# Altium project CC2511 Assignment 2.PrjPcb
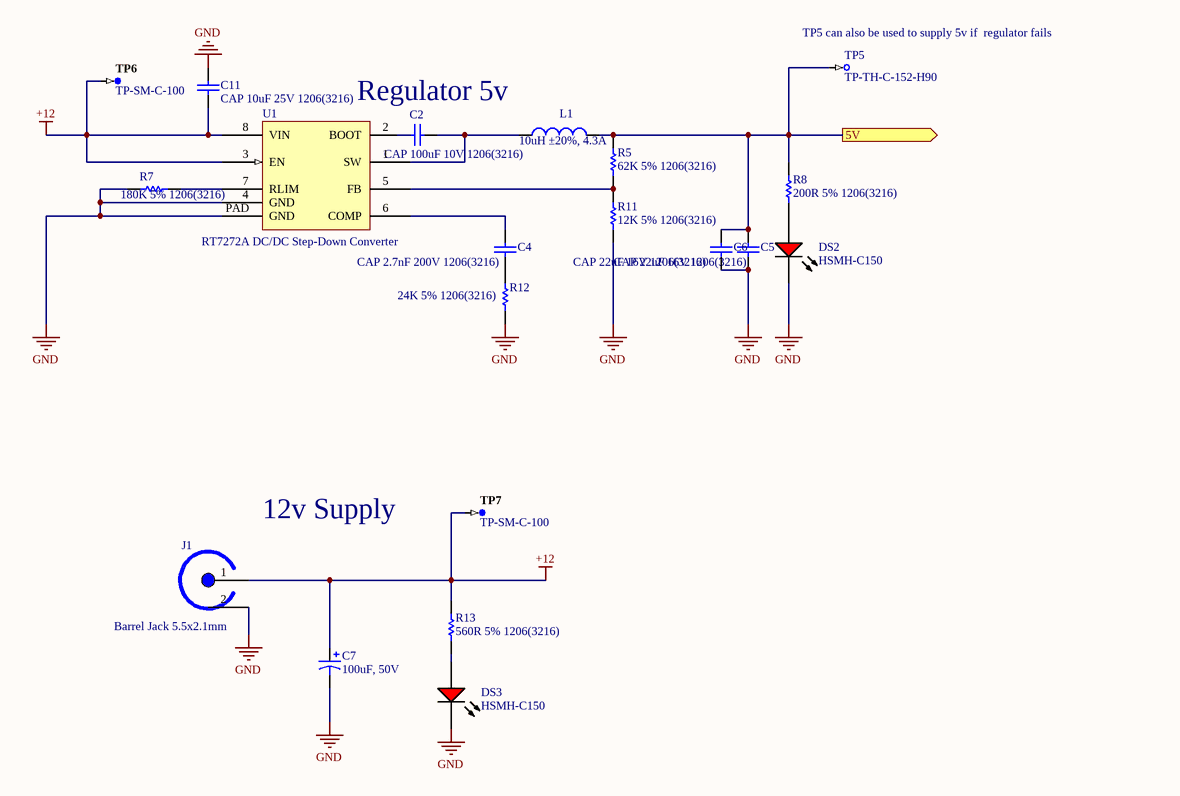
[diagram p0: Power.SchDoc]
2 sheets, 31 parts. Net scope: hierarchical (ports join the sheet entries above them; power ports are global).
Board file: PCB1.PcbDoc
Sheets:
  Power.SchDoc
  Stepper Motor Driver.SchDoc

## Sheet Power.SchDoc
size A4

### Parts
C2  CAP 100uF 10V 1206(3216)  [CAPC1206(3216)190_L]
C4  CAP 2.7nF 200V 1206(3216)  [CAPC1206(3216)100_L]
C5  CAP 22uF 16V 1206(3216)  [CAPC1206(3216)190_N]
C6  CAP 22uF 16V 1206(3216)  [CAPC1206(3216)190_N]
C7  100uF, 50V  [Capacitor radial 8mm]
C11  CAP 10uF 25V 1206(3216)  [CAPC1206(3216)190_N]
DS2  HSMH-C150  [AVAG-HSMX-C150_V]
DS3  HSMH-C150  [AVAG-HSMX-C150_V]
J1  Barrel Jack 5.5x2.1mm  [Barrel Jack 2.1x5.5mm THT]
L1  10uH ±20%, 4.3A  [Inductor SMD VLF10045 series]
R5  62K 5% 1206(3216)  [RESC1206(3216)_M]
R7  180K 5% 1206(3216)  [RESC1206(3216)_N]
R8  200R 5% 1206(3216)  [RESC1206(3216)_L]
R11  12K 5% 1206(3216)  [RESC1206(3216)_N]
R12  24K 5% 1206(3216)  [RESC1206(3216)_M]
R13  560R 5% 1206(3216)  [RESC1206(3216)_L]
TP5  TP-TH-C-152-H90  [TP-TH-C-152-H90]  (no BOM)
TP6  TP-SM-C-100  [TP-SM-C-100]  (no BOM)
TP7  TP-SM-C-100  [TP-SM-C-100]  (no BOM)
U1  RT7272A DC/DC Step-Down Converter  [RT7272A]

### Ports
5V (out)

### Nets
+12: C7.1 C11.1 J1.1(TIP) R13.1 TP6.1 TP7.1 U1.3(EN) U1.8(VIN)
GND: C5.2 C6.2 C7.2 C11.2 DS2.2(K) DS3.2(K) J1.2(SLEEVE) R7.2 R11.1 R12.1 U1.4(GND) U1.PAD(GND)
NetC2_1: C2.1 U1.2(BOOT)
NetC2_2: C2.2 L1.1 U1.1(SW)
NetC4_1: C4.1 R12.2
NetC4_2: C4.2 U1.6(COMP)
NetC5_1: C5.1 C6.1 L1.2 R5.2 R8.2 TP5.1 ; port 5V
NetDS2_1: DS2.1(A) R8.1
NetDS3_1: DS3.1(A) R13.2
NetR5_1: R5.1 R11.2 U1.5(FB)
NetR7_1: R7.1 U1.7(RLIM)

### Notes on the sheet
- (near TP5) TP5 can also be used to supply 5v if  regulator fails
- Regulator 5v
- 12v Supply
- CC2511 Assignment2 Group 3
- Date:
- Sheet
- of
- Time:
- Revision:
- Kim Bender, Peng Cheng
- Levi Smith, Fuzhen Liu
- Drawn by:
- File:

### Library data of the parts
C2 = CMP-1037-05006-1: CAP 100uF 10V ±20% 1206 (3216 Metric) Thickness 1.9mm SMD; Case-EIA: 1206; Tolerance: Â±20%; Case-Metric: 3216; Max Thickness: 1.9 mm; Technology: SMT; Rated Voltage: 10 V; Value: 100uF
C4 = CMP-1037-02898-1: CAP 2.7nF 200V ±5% 1206 (3216 Metric) Thickness 1mm SMD; Case-Metric: 3216; Case-EIA: 1206; Tolerance: Â±5%; Rated Voltage: 200 V; Technology: SMT; Max Thickness: 1 mm; Value: 2.7nF
C5 C6 = CMP-1037-04992-1: CAP 22uF 16V ±10% 1206 (3216 Metric) Thickness 1.9mm SMD; Case-EIA: 1206; Case-Metric: 3216; Tolerance: Â±10%; Rated Voltage: 16 V; Technology: SMT; Value: 22uF; Max Thickness: 1.9 mm
C7 = Cap 100uF, 50V, THT radial: Electrolytic Capacitor, 100 µF, 50 V, ± 20%, Radial Leaded, 8 mm
C11 = CMP-1037-04980-1: CAP 10uF 25V ±20% 1206 (3216 Metric) Thickness 1.9mm SMD; Case-EIA: 1206; Case-Metric: 3216; Tolerance: Â±20%; Value: 10uF; Rated Voltage: 25 V; Technology: SMT; Max Thickness: 1.9 mm
DS2 DS3 = CMP-2000-06426-1: LED Uni-Color Red, 65 mW, 25 mA, -40 to 85 degC, 2-Pin SMD, RoHS, Tape and Reel; Manufacturer: Avago; Product Height (mm): 1.1mm; Power Dissipation: 78W; Product Length (mm): 3.2mm; Forward Voltage: 2.6V; Luminous Intensity: 17mcd; DELETED: Compliant; Shape Type: Rectangular; Peak Wavelength: 660nm; Main Category: ChipLED; Dominant Wave Length: 639nm; Rad Hardened: No; Lens Type: ColorlessDiffused; Product Depth (mm): 1.6mm; Reverse Voltage: 5V; Forward Current: 25mA; Chip Material: GaAlAs; Test Current (It): 20mA; Viewing Angle: 170deg; Number of  Elements: 1; Type: Uni-Color; Package Reference: HSMX-C150; Package Description: 2-Pin Surface Mount Device, Body 3.2 x 1.6 mm; Operating Temp Range: -40Cto85C; Mounting: SurfaceMount; Emitting Color: Red; Pin Count: 2; Operating Temperature Classification: Industrial; Datasheet URL: http://media.digikey.com/pdf/Data%20Sheets/Avago%20PDFs/HSMz-Czzz.pdf; Package Type: ChipLed; Mounting Technology: SurfaceMount; High Brightness: No; Lens Dimensions: 2x1.6x0.6mm; Manufacturer URL: http://www.avagotech.com/; Lum Intensity: 17mcd; Datasheet Version: 03/2012; Packaging: TapeandReel
J1 = Barrel Jack 5.5x2.1mm: GCT DCJ200-10-A-K1-K
L1 = Inductor SMD VLF10045T-100M4R3 10uH: Inductor SMD - 10uH, 4.3A, ±20%; Value: 10uH
R5 = CMP-1014-00117-1: 62K 0.25W 5% 1206 (3216 Metric)  SMD; Case-Metric: 3216; Value: 62000.00 Ohm; Case-EIA: 1206; Technology: SMT; Tolerance: 5 %; Power: 0.25 W
R7 = CMP-1014-00128-1: 180K 0.25W 5% 1206 (3216 Metric)  SMD; Case-EIA: 1206; Value: 180000.00 Ohm; Case-Metric: 3216; Power: 0.25 W; Tolerance: 5 %; Technology: SMT
R8 = CMP-1014-00057-1: 200R 0.25W 5% 1206 (3216 Metric)  SMD; Case-EIA: 1206; Value: 200.00 Ohm; Case-Metric: 3216; Tolerance: 5 %; Technology: SMT; Power: 0.25 W
R11 = CMP-1014-00100-1: 12K 0.25W 5% 1206 (3216 Metric)  SMD; Value: 12000.00 Ohm; Case-EIA: 1206; Case-Metric: 3216; Power: 0.25 W; Tolerance: 5 %; Technology: SMT
R12 = CMP-1014-00107-1: 24K 0.25W 5% 1206 (3216 Metric)  SMD; Value: 24000.00 Ohm; Case-EIA: 1206; Case-Metric: 3216; Technology: SMT; Power: 0.25 W; Tolerance: 5 %
R13 = CMP-1014-00068-1: 560R 0.25W 5% 1206 (3216 Metric)  SMD; Case-Metric: 3216; Case-EIA: 1206; Value: 560.00 Ohm; Tolerance: 5 %; Power: 0.25 W; Technology: SMT
TP5 = CMP-0484-00003-2: Test Point, Through Hole, Hole Size 0.9 mm, PCB Mount with Silkscreen Box; Manufacturer: No Vendor; PartNumber: TP-TH-C-152-H90
TP6 TP7 = CMP-0484-00002-2: Test Point, Surface Mount, Circular, Pad Diameter 1 mm; Manufacturer: No Vendor; PartNumber: TP-SM-C-100
U1 = RT7272A DC/DC Step-Down Converter: RIchtek RT7272A 3A, 36V, 500kHz Synchronous Step-Down Converter

## Sheet Stepper Motor Driver.SchDoc
size A4; DrawnBy: KB
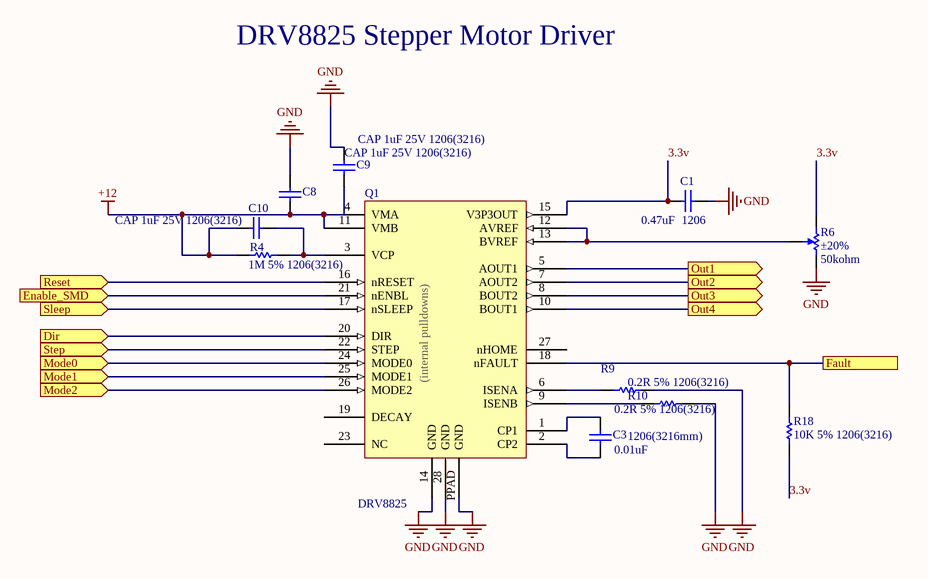
[diagram p1: Stepper Motor Driver.SchDoc]

### Parts
C1  Capacitance: 0.47uF  Package Reference: 1206  [CAPC3216X100X50NL20T25]  (hidden comment: 1206C474K5RACTU)
C3  Case Size: 1206(3216mm)  Capacitance: 0.01uF  [KEMT-1206-2_L]  (hidden comment: C1206C103K5RACTU)
C8  CAP 1uF 25V 1206(3216)  [CAPC1206(3216)170_M]
C9  CAP 1uF 25V 1206(3216)  [CAPC1206(3216)170_M]
C10  CAP 1uF 25V 1206(3216)  [CAPC1206(3216)170_M]
Q1  DRV8825  [DRV8825 HTSSOP]
R4  1M 5% 1206(3216)  [RESC1206(3216)_L]
R6  Resistance Tolerance: ±20%  Track Resistance: 50kohm  [BOUR-3313J-1_V]  (hidden comment: 3313J-1-503E)
R9  0.2R 5% 1206(3216)  [RESC1206(3216)_L]
R10  0.2R 5% 1206(3216)  [RESC1206(3216)_L]
R18  10K 5% 1206(3216)  [RESC1206(3216)_M]

### Ports
Dir (in), Enable_SMD (in), Fault, Mode0 (in), Mode1 (in), Mode2 (in), Out1 (out), Out2 (out), Out3 (out), Out4 (out), Reset (in), Sleep (in), Step (in)

### Nets
+12: C8.1 C9.1 C10.2 Q1.4(VMA) Q1.11(VMB) R4.1
GND: C1.2 C8.2 C9.2 Q1.14(GND) Q1.28(GND) Q1.PPAD(GND) R6.3 R9.2 R10.2
3.3v: C1.1 Q1.15(V3P3OUT) R6.1 R18.1
NetC3_1: C3.1 Q1.2(CP2)
NetC3_2: C3.2 Q1.1(CP1)
NetC10_1: C10.1 Q1.3(VCP) R4.2
NetQ1_5: Q1.5(AOUT1) ; port Out1
NetQ1_6: Q1.6(ISENA) R9.1
NetQ1_7: Q1.7(AOUT2) ; port Out2
NetQ1_8: Q1.8(BOUT2) ; port Out3
NetQ1_9: Q1.9(ISENB) R10.1
NetQ1_10: Q1.10(BOUT1) ; port Out4
NetQ1_12: Q1.12(AVREF) Q1.13(BVREF) R6.2
NetQ1_16: Q1.16(nRESET) ; port Reset
NetQ1_17: Q1.17(nSLEEP) ; port Sleep
NetQ1_18: Q1.18(nFAULT) R18.2 ; port Fault
NetQ1_20: Q1.20(DIR) ; port Dir
NetQ1_21: Q1.21(nENBL) ; port Enable_SMD
NetQ1_22: Q1.22(STEP) ; port Step
NetQ1_24: Q1.24(MODE0) ; port Mode0
NetQ1_25: Q1.25(MODE1) ; port Mode1
NetQ1_26: Q1.26(MODE2) ; port Mode2

Not connected (* = marked no-connect by the designer): Q1 19(DECAY) 23(NC) 27(nHOME)

### Notes on the sheet
- DRV8825 Stepper Motor Driver
- CC2511 Assignment2 Group 3
- Date:
- Sheet
- of
- Time:
- Revision:
- Kim Bender, Peng Cheng
- Levi Smith, Fuzhen Liu
- Drawn by:
- File:
- (in symbol Stepper motor driver DRV8825) (internal pulldowns)

### Library data of the parts
C1 = CMP-2000-06016-1: Chip Capacitor, 470 nF, +/- 10%, 50 V, -55 to 125 degC, 1206 (3216 Metric), RoHS, Tape and Reel; Manufacturer: Kemet; Case Length: 3.2mm; Class: 2; Case Height: 0.9mm; Capacitance - pF: 470000pF; Capacitance - nF: 470nF; Dielectric: X7R; Voltage Rating DC: 50V; Case Width: 1.6mm; Temperature Coefficient / Code: +/-15%; Type: SMDMLCCsX7R,Commercial; Manufacturer URL: http://www.kemet.com/; Maximum Operating Temperature: +125C; Minimum Operating Temperature: -55C; Brand: Kemet; Case Code - in: 1206; Datasheet Version: 02/2016; Case Code - mm: 3216; Series: C1206C; Mounting Technology: SurfaceMount; Termination Style: SMD/SMT; Tolerance: 10%; Datasheet URL: http://www.kemet.com/docfinder?Partnumber=C1206C106K8RACTU; Dimensions: 1.6mmWx3.2mmLx0.9mmH; Packaging: Reel; Factory Pack Quantity: 4000; Product Category: MultilayerCeramicCapacitorsMLCC-SMD/SMT; RoHS: Details; Operating Temperature Range: -55Cto+125C; Product: GeneralTypeMLCCs; Package Description: 2-Pin Surface Mount Device, Body 3.2 x 1.6 mm; Package / Case: 1206(3216metric); Voltage Rating: 50V
C3 = CMP-2000-06008-1: Surface Mount Multilayer Ceramic Chip Capacitor, X7R Dielectric, 50 V, -55 to 125 degC, 2-Pin SMD (1206), RoHS, Tape and Reel; Manufacturer: Kemet; Voltage Rating: 50V; Brand/Series: CSeries; Tolerance: 10%; Mounting Technology: SurfaceMount; Material, Element: Ceramic; Termination: SMD; Temperature Coefficient: X7R; Package Reference: 1206-2; Dimensions: 0.126"x0.063"(3.2x1.6mm)LxW; Package Description: 2-Leads SMD, Body 3.2 x 1.6 mm; Datasheet Version: 07/2013; Manufacturer URL: http://www.kemet.com/; Mounting Type: PCB; Datasheet URL: https://datasheet.ciiva.com/7729/1725435-7729792.pdf
C8-C10 = CMP-1037-04701-1: CAP 1uF 25V ±10% 1206 (3216 Metric) Thickness 1.7mm SMD; Case-Metric: 3216; Tolerance: Â±10%; Case-EIA: 1206; Rated Voltage: 25 V; Value: 1uF; Max Thickness: 1.7 mm; Technology: SMT
Q1 = Stepper motor driver DRV8825: TI DRV8825 Stepper Motor Controller IC
R4 = CMP-1014-00146-1: 1M 0.25W 5% 1206 (3216 Metric)  SMD; Value: 1000000.00 Ohm; Case-EIA: 1206; Case-Metric: 3216; Power: 0.25 W; Technology: SMT; Tolerance: 5 %
R6 = CMP-2000-05588-1: 3 mm Trimpot(R) Trimming Potentiometer, 50 KOhm, +/- 20%, 0.125 W, -55 to 125 degC, 3-Pin SMD, RoHS, Tape and Reel; Manufacturer: Bourns; SVHC: NoSVHC(19-Dec-2012); Temperature Coefficient: ±150ppm/°C; No. of Turns: 1; Power Rating: 125mW; Manufacturer URL: http://www.bourns.com/; Potentiometer Mounting: SMD; Package Description: 3-Pin Surface Mount Device, Body 3.5 x 3.2 mm, Pitch 1.15 mm; Package Reference: 3313J-1; Mounting Technology: SurfaceMount; Datasheet Version: 05/2016; Datasheet URL: http://www.bourns.com/docs/Product-Datasheets/3313.pdf; Parameter 1: *
R9 R10 = CMP-1014-00057-1: 0.2R 0.25W 5% 1206 (3216 Metric)  SMD; Case-EIA: 1206; Value: 200.00 Ohm; Case-Metric: 3216; Tolerance: 5 %; Technology: SMT; Power: 0.25 W
R18 = CMP-1014-00098-1: 10K 0.25W 5% 1206 (3216 Metric)  SMD; Value: 10000.00 Ohm; Case-Metric: 3216; Case-EIA: 1206; Power: 0.25 W; Tolerance: 5 %; Technology: SMT

## Nets that join several sheets
+12: Power (8 pins), Stepper Motor Driver (6 pins)
GND: Power (12 pins), Stepper Motor Driver (9 pins)